# EasyEDA schematic PCB-3 _SCH_PHOENIX.json
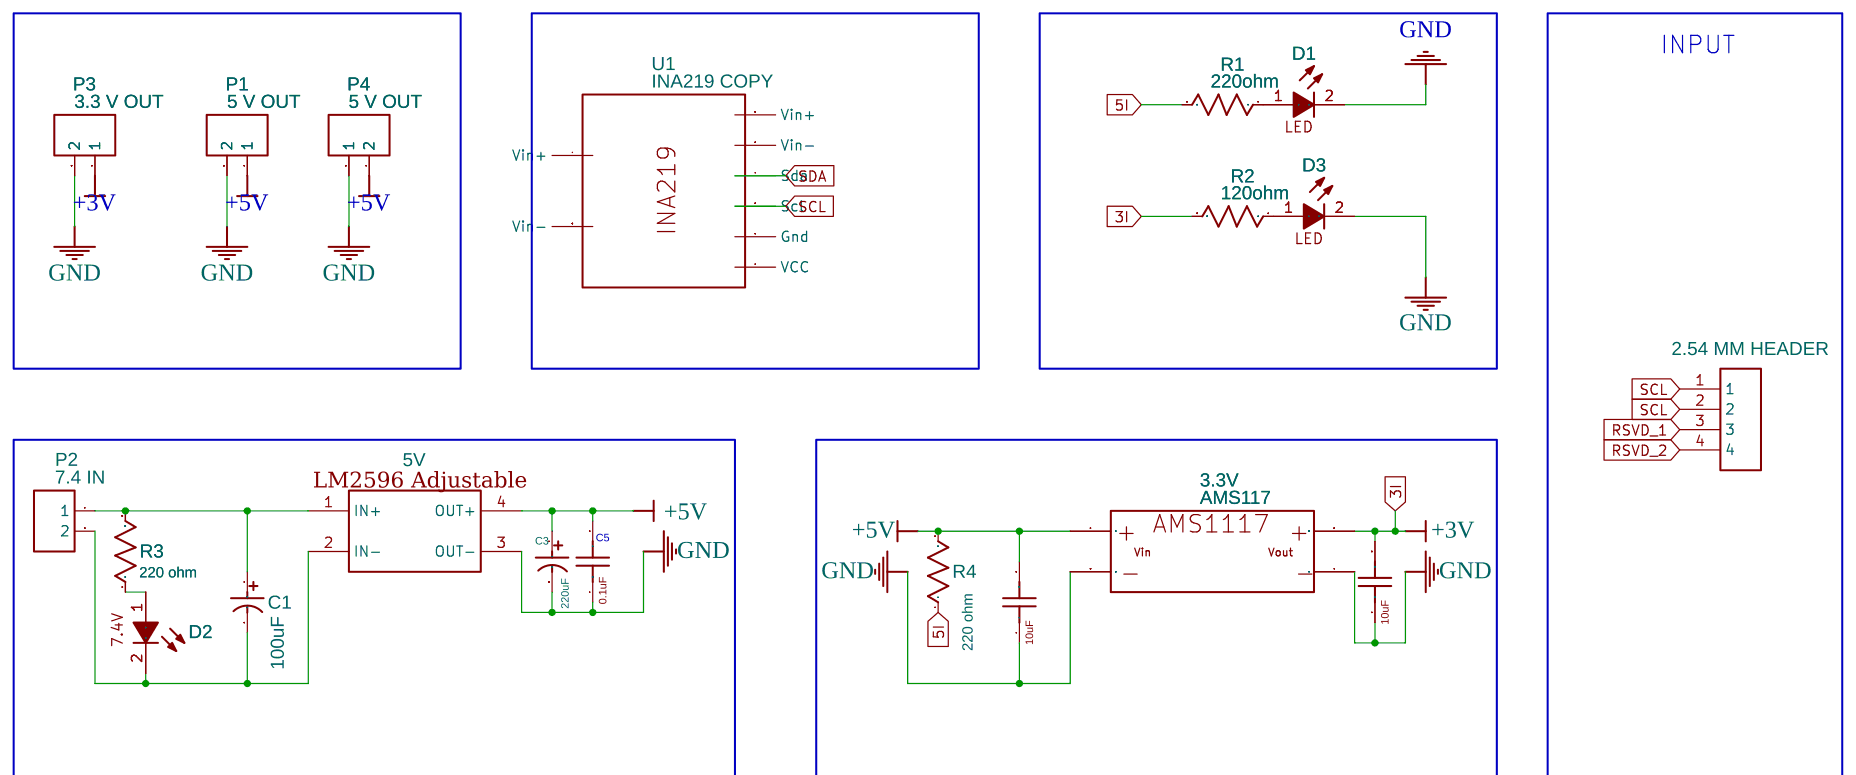
[diagram p0: schematic sheet]

## Parts
3.3V  AMS117  [AMS117]
5V  LM2596 ADJ COPY  [LM2596:YAAJ_DCDC_STEPDOWN_LM2596]
C1  100uF  [CAPACITOR, 100UF 2.54MM PIN CAPACITOR]
C2  22PF CERAMIC CAPACITOR  [GENCERAMICCAPACITOR]
C3  220uF  [CAPACITOR, 100UF 2.54MM PIN CAPACITOR]
C4  22PF CERAMIC CAPACITOR  [GENCERAMICCAPACITOR]
C5  22PF CERAMIC CAPACITOR  [GENCERAMICCAPACITOR]
D1  LED  [LED-TH_LED-DP2-2LED-AMCC]
D2  LED  [LED-TH_LED-DP2-2LED-AMCC]
D3  LED  [LED-TH_LED-DP2-2LED-AMCC]
H1  2.54 MM HEADER  [B2B 2.54 MM HEADER]
P1  5 V OUT  [CONN-TH_2P-P5.00]
P2  7.4 IN  [CONN-TH_2P-P5.00]
P3  3.3 V OUT  [CONN-TH_2P-P5.00]
P4  5 V OUT  [CONN-TH_2P-P5.00]
R1  220ohm  [RESISTOR TH]
R2  120ohm  [RESISTOR TH]
R3  220 ohm  [R0603]
R4  220 ohm  [R0603]
U1  INA219 COPY  [INA219-AURDINO]

## Library data of the parts
3.3V = AMS117: Contributor: Павел Толкачёв
5V = BuckConverters_LM2596_Adj: Servo 5V; Add into BOM: yes; Convert to PCB: yes; Origin Footprint: YAAJ_DCDC_StepDown_LM2596; Contributor: ottello
C1 C3 = capacitor 680uF: Supplier: LCSC; Manufacturer: CX(承兴); Manufacturer Part: KM476M016D11RR0VH2FP0; Supplier Part: C22320; JLCPCB Part Class: Extended Part; Contributor: sumitgupta
C2 C4 C5 = 22PF CERAMIC CAPACITOR: Contributor: Giann De Leon
D1-D3 = LED: Supplier: Digi-Key; Manufacturer: VccLite; Manufacturer Part: 5600; Supplier Part: L20325-ND; link: https://vcclite.com/product/5602f5-5v/; Contributor: brandonmeza
H1 = B2B 2.54 MM HEADER: Manufacturer: MULTICOMP PRO; Manufacturer Part: 2211S-04G; Supplier Part: 1593413; Supplier: Element14; link: https://au.element14.com/multicomp/2211s-03g/header-1-row-vert-3way/dp/1593412?st=2211S-03G; Contributor: alexandriamckie
P1-P4 = CONN-TH_2P-P5.00: Supplier: LCSC; Contributor: LCEDA_Lib
R1-R4 = R_0603_US: Contributor: LCEDA_Lib
U1 = INA219 COPY: Manufacturer Part: INA219; Supplier Part: INA219; Supplier: AdaFruit; link: https://www.adafruit.com/product/904; Contributor: Mage34

## Nets
+3V: 3.3V.3 C5.2 P3.1 R2.2
+5V: 3.3V.1 5V.4(OUT+) C2.2 C3.1 C4.2 P1.1 P4.1(2) R4.2
GND: 3.3V.2 3.3V.4 5V.3(OUT-) C2.1 C3.2 C4.1 C5.1 D1.2(K) D3.2(K) P1.2 P3.2 P4.2(1)
5I: R1.2 R4.1
RSVD_1: H1.3
RSVD_2: H1.4
SCL: H1.1 H1.2 U1.3(Scl)
SDA: U1.4(Sda)
Net-(5V-1): 5V.1(IN+) C1.1 P2.1 R3.2
Net-(5V-2): 5V.2(IN-) C1.2 D2.2(K) P2.2
Net-(D1-1): D1.1(A) R1.1
Net-(D2-1): D2.1(A) R3.1
Net-(D3-1): D3.1(A) R2.1

Not connected (* = marked no-connect by the designer): U1 1(VCC) 2(Gnd) 5(Vin-) 6(Vin+) 7(Vin+) 8(Vin-)

## Notes on the sheet
- INPUT
- C5
